# Altium schematic sheet receiver.SchDoc
size A
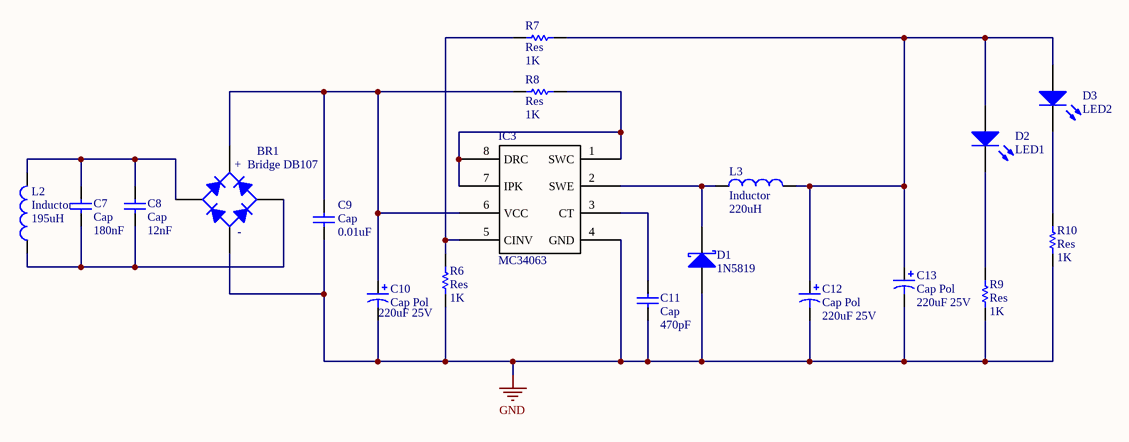
[diagram p0: receiver.SchDoc]

## Parts
BR1  Bridge DB107  [D-38]
C7  Cap  value 180nF  [RAD-0.3]
C8  Cap  value 12nF  [RAD-0.3]
C9  Cap  value 0.01uF  [RAD-0.3]
C10  Cap Pol  value 220uF 25V  [RB7.6-15]
C11  Cap  value 470pF  [RAD-0.3]
C12  Cap Pol  value 220uF 25V  [RB7.6-15]
C13  Cap Pol  value 220uF 25V  [RB7.6-15]
D1  1N5819  [DIODE-0.4]
D2  LED1  [LED-0]
D3  LED2  [LED-0]
IC3  MC34063  [PDIP-8]
L2  Inductor  value 195uH  [HDR1X2]
L3  Inductor  value 220uH  [AXIAL-0.4]
R6  Res  value 1K  [AXIAL-0.3]
R7  Res  value 1K  [AXIAL-0.3]
R8  Res  value 1K  [AXIAL-0.3]
R9  Res  value 1K  [AXIAL-0.3]
R10  Res  value 1K  [AXIAL-0.3]

## Nets
GND: BR1.3(A) C9.1 C10.2 C11.1 C12.2 C13.2 D1.2(A) IC3.4(GND) R6.1 R9.2 R10.2
NetBR1_1: BR1.1(K) C9.2 C10.1 IC3.6(VCC) R8.2
NetBR1_2: BR1.2(C) C7.1 C8.1 L2.1
NetBR1_4: BR1.4(C) C7.2 C8.2 L2.2
NetC11_2: C11.2 IC3.3(CT)
NetC12_1: C12.1 C13.1 D2.1(A) D3.1(A) L3.2 R7.1
NetD1_1: D1.1(K) IC3.2(SWE) L3.1
NetD2_2: D2.2(K) R9.1
NetD3_2: D3.2(K) R10.1
NetIC3_1: IC3.1(SWC) IC3.7(IPK) IC3.8(DRC) R8.1
NetIC3_5: IC3.5(CINV) R6.2 R7.2

## Notes on the sheet
- (near BR1) +
- (near BR1) -

## Library data of the parts
BR1 = Bridge1: Full Wave Diode Bridge; Published: 8-Jun-2000; LatestRevisionDate: 29-May-2009; LatestRevisionNote: Sch pins A & K swapped.; DatasheetVersion: E2732B; PackageReference: D-38; Publisher: Altium Limited; PackageDescription: Bridge Rectifier; 4 Terminals; Body 9.4 x 9.4 mm (typ); Pitch 5.08 mm
C7-C9 C11 = Cap: Capacitor; Published: 8-Jun-2000; LatestRevisionDate: 17-Jul-2002; LatestRevisionNote: Re-released for DXP Platform.; PackageReference: RAD-0.3; Publisher: Altium Limited; PackageDescription: Radial Cap, Thru-Hole; 2 Leads; 0.3 in Pin Spacing
C10 C12 C13 = Cap Pol1: Polarized Capacitor (Radial); Published: 8-Jun-2000; LatestRevisionDate: 17-Jul-2002; LatestRevisionNote: Re-released for DXP Platform.; PackageReference: RB7.6-15; Publisher: Altium Limited; PackageDescription: Polarized Capacitor (Radial); 2 Leads
D1 = Diode 10TQ035: Schottky Rectifier; Note: Terminal 2 is the TAB and is electrically connected to the cathode; Published: 8-Jun-2000; LatestRevisionDate: 17-Jul-2002; LatestRevisionNote: Re-released for DXP Platform.; DatasheetVersion: PD-2.057B; PackageVersion: Feb-1998; PackageReference: TO-220AC; Publisher: Altium Limited; PackageDescription: TO, Thru-Hole, Vertical, Heatsink Mounted; 3 In-Line Leads (1 Absent); Pitch 2.54 mm; ComponentLink1Description: Manufacturer Link; ComponentLink1URL: http://www.irf.com/; ComponentLink2Description: Datasheet; ComponentLink2URL: http://www.irf.com/product-info/datasheets/data/10tq.pdf
D2 D3 = LED0: Typical INFRARED GaAs LED; Published: 8-Jun-2000; LatestRevisionDate: 08-Jul-2005; LatestRevisionNote: Mech Layer 1 removed.; PackageReference: LED-0; Publisher: Altium Limited; PackageDescription: LED; 2 Leads
L2 L3 = Inductor: Code_IEC: 1005; Published: 8-Jun-2000; LatestRevisionDate: 29-May-2009; LatestRevisionNote: IPC-7351 Footprint Added.; PackageReference: 0402-A; Publisher: Altium Limited; PackageDescription: Chip Inductor; Code_JEITA: 0402
R6-R10 = Res1: Resistor; Published: 8-Jun-2000; LatestRevisionDate: 17-Jul-2002; LatestRevisionNote: Re-released for DXP Platform.; PackageReference: AXIAL-0.3; Publisher: Altium Limited; PackageDescription: Axial Device, Thru-Hole; 2 Leads; 0.3 in Pin Spacing